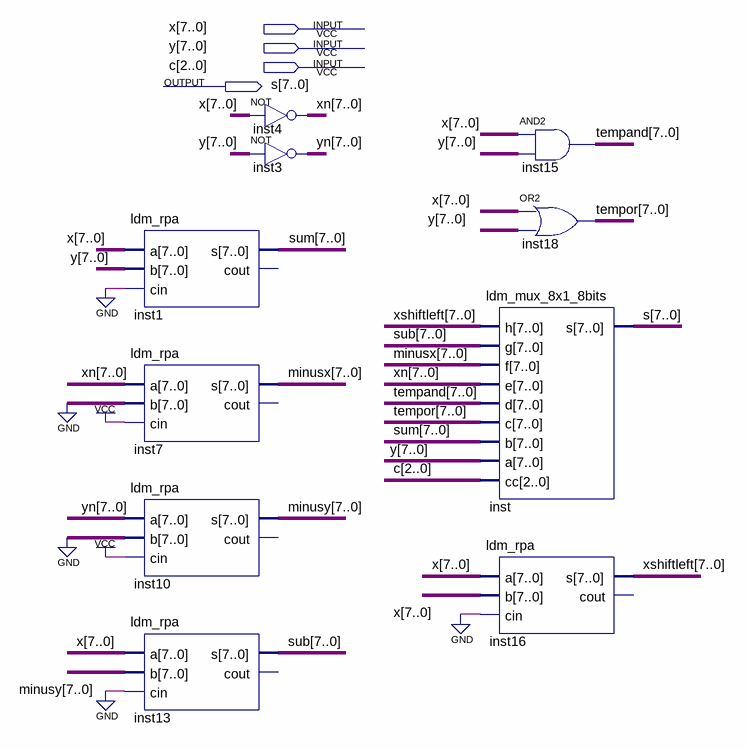
[diagram p0: schematic sheet]
// Quartus schematic ldm_ula.bdf as structural Verilog: 10 symbols, 4 pins
module ldm_ula (
  input  [7:0] x,
  input  [7:0] y,
  input  [2:0] c,
  output [7:0] s
);

  wire [7:0] minusx, minusy, sub, sum, tempand, tempor, xn, xshiftleft, yn;

  ldm_rpa inst1 (.a(x), .b(y), .cin(1'b0), .s(sum));  // open: cout
  ldm_rpa inst7 (.a(xn), .b({8{1'b0}}), .cin(1'b1), .s(minusx));  // open: cout
  ldm_rpa inst10 (.a(yn), .b({8{1'b0}}), .cin(1'b1), .s(minusy));  // open: cout
  ldm_rpa inst13 (.a(x), .b(minusy), .cin(1'b0), .s(sub));  // open: cout
  assign xn = ~x;  // NOT inst4, 8 bits wide
  assign yn = ~y;  // NOT inst3, 8 bits wide
  assign tempand = x & y;  // AND2 inst15, 8 bits wide
  assign tempor = x | y;  // OR2 inst18, 8 bits wide
  ldm_mux_8x1_8bits inst (
    .h(xshiftleft), .g(sub), .f(minusx), .e(xn), .d(tempand), .c(tempor), .b(sum), .a(y), .cc(c), .s(s));
  ldm_rpa inst16 (.a(x), .b(x), .cin(1'b0), .s(xshiftleft));  // open: cout
endmodule
